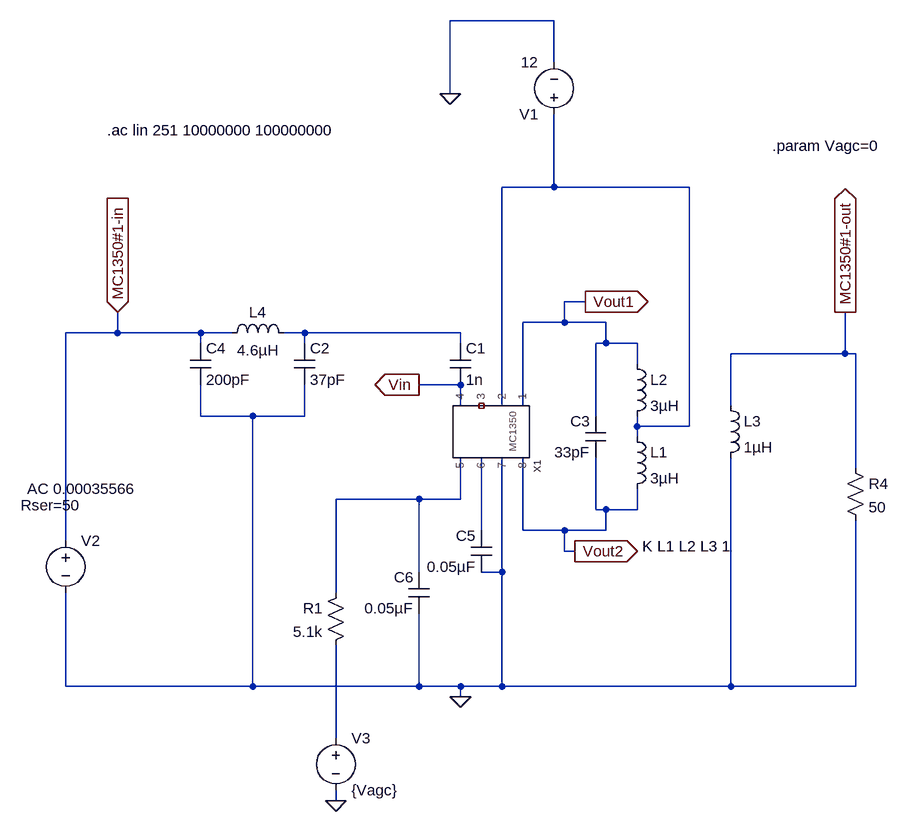
[diagram p0: schematic MC1350 test circuit 2.asc]
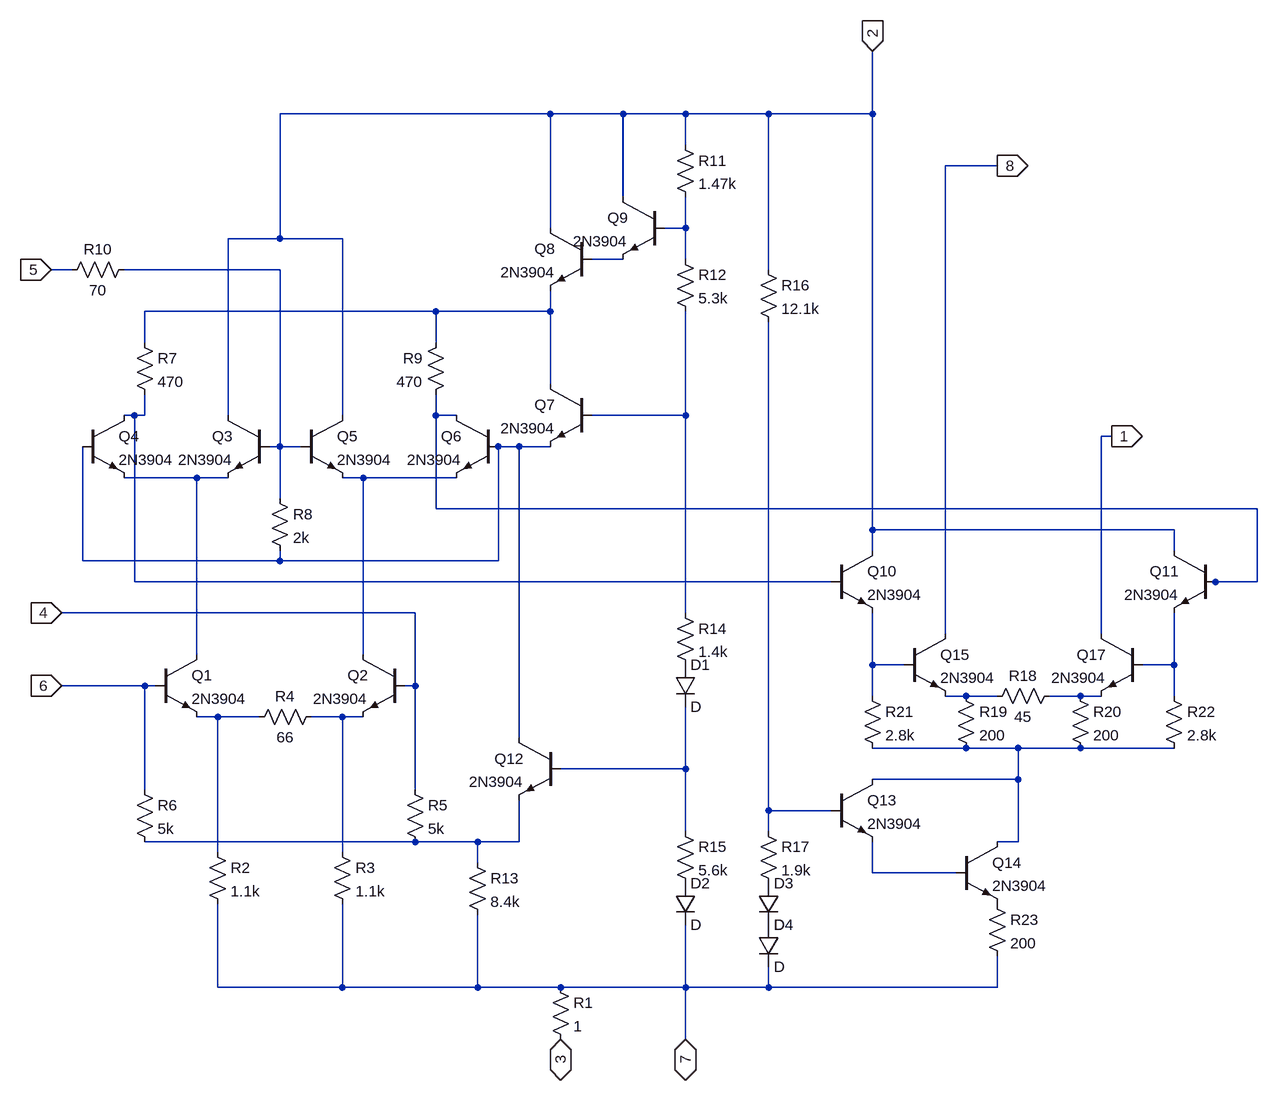
[diagram p1: sub-circuit mc1350_v1.asc]
MC1350 test circuit 2.asc, the LTspice schematic file:
Version 4.1
SHEET 1 1520 756
WIRE 320 -560 160 -560
WIRE 320 -496 320 -560
WIRE 160 -448 160 -560
WIRE 320 -304 320 -416
WIRE 320 -304 240 -304
WIRE 528 -304 320 -304
WIRE 368 -128 336 -128
WIRE 336 -96 336 -128
WIRE 336 -96 272 -96
WIRE 400 -96 336 -96
WIRE -352 -80 -352 -112
WIRE -352 -80 -432 -80
WIRE -224 -80 -352 -80
WIRE -176 -80 -224 -80
WIRE -64 -80 -96 -80
WIRE 176 -80 -64 -80
WIRE -224 -64 -224 -80
WIRE -64 -64 -64 -80
WIRE 176 -64 176 -80
WIRE 400 -64 400 -96
WIRE 400 -64 384 -64
WIRE 448 -64 400 -64
WIRE 768 -48 768 -112
WIRE 768 -48 592 -48
WIRE 784 -48 768 -48
WIRE 448 -32 448 -64
WIRE 176 0 112 0
WIRE 176 32 176 0
WIRE 240 32 240 -304
WIRE 272 32 272 -96
WIRE 592 32 592 -48
WIRE -224 48 -224 0
WIRE -144 48 -224 48
WIRE -64 48 -64 0
WIRE -64 48 -144 48
WIRE 384 48 384 -64
WIRE 448 64 448 48
WIRE 528 64 528 -304
WIRE 528 64 448 64
WIRE 448 80 448 64
WIRE 784 128 784 -48
WIRE 112 176 -16 176
WIRE 176 176 176 112
WIRE 176 176 112 176
WIRE 384 192 384 112
WIRE 400 192 384 192
WIRE 448 192 448 160
WIRE 448 192 400 192
WIRE 208 224 208 112
WIRE 272 224 272 112
WIRE 336 224 272 224
WIRE 400 224 400 192
WIRE 400 224 336 224
WIRE -432 240 -432 -80
WIRE 336 256 336 224
WIRE 352 256 336 256
WIRE 112 288 112 176
WIRE 240 288 240 112
WIRE 240 288 208 288
WIRE -16 320 -16 176
WIRE -432 464 -432 320
WIRE -144 464 -144 48
WIRE -144 464 -432 464
WIRE 112 464 112 352
WIRE 112 464 -144 464
WIRE 176 464 112 464
WIRE 240 464 240 288
WIRE 240 464 176 464
WIRE 592 464 592 112
WIRE 592 464 240 464
WIRE 784 464 784 208
WIRE 784 464 592 464
WIRE 176 480 176 464
WIRE -16 544 -16 400
WIRE -16 640 -16 624
FLAG 160 -448 0
FLAG 176 480 0
FLAG 768 -112 MC1350#1-out
IOPIN 768 -112 Out
FLAG -352 -112 MC1350#1-in
IOPIN -352 -112 In
FLAG -16 640 0
FLAG 112 0 Vin
IOPIN 112 0 Out
FLAG 368 -128 Vout1
IOPIN 368 -128 Out
FLAG 352 256 Vout2
IOPIN 352 256 Out
SYMBOL voltage 320 -400 R180
WINDOW 123 0 0 Left 0
WINDOW 39 0 0 Left 0
SYMATTR InstName V1
SYMATTR Value 12
SYMBOL voltage -432 224 R0
WINDOW 123 -59 -64 Left 2
WINDOW 39 -69 -39 Left 2
SYMATTR Value2 AC 0.00035566
SYMATTR SpiceLine Rser=50
SYMATTR InstName V2
SYMATTR Value ""
SYMBOL ind 432 64 R0
SYMATTR InstName L1
SYMATTR Value 3µH
SYMBOL cap 400 112 R180
WINDOW 0 24 56 Left 2
WINDOW 3 24 8 Left 2
SYMATTR InstName C3
SYMATTR Value 33pF
SYMBOL voltage -16 528 R0
WINDOW 123 0 0 Left 0
WINDOW 39 0 0 Left 0
SYMATTR InstName V3
SYMATTR Value {Vagc}
SYMBOL res 768 112 R0
SYMATTR InstName R4
SYMATTR Value 50
SYMBOL RF\ signal\ amps\\MC1350_v1 224 64 R90
SYMATTR InstName X1
SYMBOL ind 432 -48 R0
SYMATTR InstName L2
SYMATTR Value 3µH
SYMBOL ind 576 16 R0
SYMATTR InstName L3
SYMATTR Value 1µH
SYMBOL cap 160 -64 R0
SYMATTR InstName C1
SYMATTR Value 1n
SYMBOL cap -80 -64 R0
SYMATTR InstName C2
SYMATTR Value 37pF
SYMBOL cap -240 -64 R0
SYMATTR InstName C4
SYMATTR Value 200pF
SYMBOL ind -192 -64 R270
WINDOW 0 32 56 VTop 2
WINDOW 3 5 56 VBottom 2
SYMATTR InstName L4
SYMATTR Value 4.6µH
SYMBOL cap 224 224 M0
SYMATTR InstName C5
SYMATTR Value 0.05µF
SYMBOL cap 128 288 M0
SYMATTR InstName C6
SYMATTR Value 0.05µF
SYMBOL res 0 304 M0
SYMATTR InstName R1
SYMATTR Value 5.1k
TEXT -368 -392 Left 2 !.ac lin 251 10000000 100000000
TEXT 656 -368 Left 2 !.param Vagc=0
TEXT 456 248 Left 2 !K L1 L2 L3 1

mc1350_v1.asc, the sub-circuit schematic file:
Version 4.1
SHEET 1 2180 940
WIRE 608 -576 192 -576
WIRE 720 -576 608 -576
WIRE 816 -576 720 -576
WIRE 944 -576 816 -576
WIRE 1104 -576 1104 -672
WIRE 1104 -576 944 -576
WIRE 816 -528 816 -576
WIRE 1296 -496 1216 -496
WIRE 720 -448 720 -576
WIRE 608 -400 608 -576
WIRE 816 -400 816 -448
WIRE 816 -400 784 -400
WIRE 192 -384 192 -576
WIRE 192 -384 112 -384
WIRE 288 -384 192 -384
WIRE 720 -352 672 -352
WIRE 816 -352 816 -400
WIRE -128 -336 -160 -336
WIRE 192 -336 -48 -336
WIRE 944 -336 944 -576
WIRE 432 -272 -16 -272
WIRE 608 -272 608 -304
WIRE 608 -272 432 -272
WIRE -16 -224 -16 -272
WIRE 432 -224 432 -272
WIRE 608 -160 608 -272
WIRE -32 -112 -48 -112
WIRE -16 -112 -16 -144
WIRE -16 -112 -32 -112
WIRE 112 -112 112 -384
WIRE 288 -112 288 -384
WIRE 432 -112 432 -144
WIRE 464 -112 432 -112
WIRE 816 -112 816 -272
WIRE 816 -112 672 -112
WIRE 1472 -80 1456 -80
WIRE 192 -64 192 -336
WIRE 192 -64 176 -64
WIRE 224 -64 192 -64
WIRE 528 -64 512 -64
WIRE 560 -64 528 -64
WIRE 608 -64 560 -64
WIRE 64 -16 -48 -16
WIRE 112 -16 64 -16
WIRE 320 -16 288 -16
WIRE 464 -16 320 -16
WIRE 192 16 192 -64
WIRE 432 32 432 -112
WIRE 1696 32 432 32
WIRE 1104 64 1104 -576
WIRE 1568 64 1104 64
WIRE 1104 96 1104 64
WIRE 1568 96 1568 64
WIRE -112 112 -112 -64
WIRE 192 112 192 96
WIRE 192 112 -112 112
WIRE 528 112 528 -64
WIRE 528 112 192 112
WIRE -32 144 -32 -112
WIRE 1040 144 -32 144
WIRE 1632 144 1616 144
WIRE 1696 144 1696 32
WIRE 1696 144 1632 144
WIRE 400 192 -144 192
WIRE 816 192 816 -112
WIRE 1216 224 1216 -496
WIRE 1456 224 1456 -80
WIRE 64 256 64 -16
WIRE 320 256 320 -16
WIRE 1104 272 1104 192
WIRE 1152 272 1104 272
WIRE 1568 272 1568 192
WIRE 1568 272 1520 272
WIRE -16 304 -144 304
WIRE 0 304 -16 304
WIRE 400 304 400 192
WIRE 400 304 384 304
WIRE 1104 320 1104 272
WIRE 1248 320 1216 320
WIRE 1296 320 1248 320
WIRE 1424 320 1376 320
WIRE 1456 320 1424 320
WIRE 1568 320 1568 272
WIRE 96 352 64 352
WIRE 160 352 96 352
WIRE 288 352 240 352
WIRE 320 352 288 352
WIRE 560 384 560 -64
WIRE 1248 400 1104 400
WIRE 1328 400 1248 400
WIRE 1424 400 1328 400
WIRE 1568 400 1424 400
WIRE 816 432 816 336
WIRE 816 432 624 432
WIRE 1328 448 1328 400
WIRE 1328 448 1104 448
WIRE -16 464 -16 304
WIRE 400 464 400 304
WIRE 944 496 944 -256
WIRE 1040 496 944 496
WIRE 816 528 816 432
WIRE 944 528 944 496
WIRE 400 544 -16 544
WIRE 496 544 400 544
WIRE 560 544 560 480
WIRE 560 544 496 544
WIRE 1328 544 1328 448
WIRE 1328 544 1296 544
WIRE 96 560 96 352
WIRE 288 560 288 352
WIRE 496 576 496 544
WIRE 1104 592 1104 544
WIRE 1232 592 1104 592
WIRE 96 768 96 640
WIRE 288 768 288 640
WIRE 288 768 96 768
WIRE 496 768 496 656
WIRE 496 768 288 768
WIRE 624 768 496 768
WIRE 816 768 816 672
WIRE 816 768 624 768
WIRE 944 768 944 736
WIRE 944 768 816 768
WIRE 1296 768 1296 720
WIRE 1296 768 944 768
WIRE 816 848 816 768
FLAG -144 304 6
IOPIN -144 304 In
FLAG 816 848 7
IOPIN 816 848 BiDir
FLAG -144 192 4
IOPIN -144 192 In
FLAG -160 -336 5
IOPIN -160 -336 In
FLAG 1104 -672 2
IOPIN 1104 -672 In
FLAG 1296 -496 8
IOPIN 1296 -496 Out
FLAG 1472 -80 1
IOPIN 1472 -80 Out
FLAG 624 848 3
IOPIN 624 848 BiDir
SYMBOL res 80 544 R0
SYMATTR InstName R2
SYMATTR Value 1.1k
SYMBOL npn 0 256 R0
SYMATTR InstName Q1
SYMATTR Value 2N3904
SYMBOL npn 384 256 M0
SYMATTR InstName Q2
SYMATTR Value 2N3904
SYMBOL res 272 544 R0
SYMATTR InstName R3
SYMATTR Value 1.1k
SYMBOL res 256 336 R90
WINDOW 0 0 56 VBottom 2
WINDOW 3 32 56 VTop 2
SYMATTR InstName R4
SYMATTR Value 66
SYMBOL res 384 448 R0
SYMATTR InstName R5
SYMATTR Value 5k
SYMBOL res -32 448 R0
SYMATTR InstName R6
SYMATTR Value 5k
SYMBOL npn 176 -112 M0
SYMATTR InstName Q3
SYMATTR Value 2N3904
SYMBOL npn -112 -112 R0
SYMATTR InstName Q4
SYMATTR Value 2N3904
SYMBOL res -32 -240 R0
SYMATTR InstName R7
SYMATTR Value 470
SYMBOL res 176 0 R0
SYMATTR InstName R8
SYMATTR Value 2k
SYMBOL npn 224 -112 R0
SYMATTR InstName Q5
SYMATTR Value 2N3904
SYMBOL npn 528 -112 M0
SYMATTR InstName Q6
SYMATTR Value 2N3904
SYMBOL res 448 -240 M0
SYMATTR InstName R9
SYMATTR Value 470
SYMBOL res -32 -352 R90
WINDOW 0 0 56 VBottom 2
WINDOW 3 32 56 VTop 2
SYMATTR InstName R10
SYMATTR Value 70
SYMBOL npn 672 -160 M0
SYMATTR InstName Q7
SYMATTR Value 2N3904
SYMBOL npn 672 -400 M0
SYMATTR InstName Q8
SYMATTR Value 2N3904
SYMBOL npn 784 -448 M0
SYMATTR InstName Q9
SYMATTR Value 2N3904
SYMBOL res 800 -544 R0
SYMATTR InstName R11
SYMATTR Value 1.47k
SYMBOL res 800 -368 R0
SYMATTR InstName R12
SYMATTR Value 5.3k
SYMBOL npn 1040 96 R0
SYMATTR InstName Q10
SYMATTR Value 2N3904
SYMBOL npn 1632 96 M0
SYMATTR InstName Q11
SYMATTR Value 2N3904
SYMBOL npn 624 384 M0
SYMATTR InstName Q12
SYMATTR Value 2N3904
SYMBOL res 480 560 R0
SYMATTR InstName R13
SYMATTR Value 8.4k
SYMBOL res 800 176 R0
SYMATTR InstName R14
SYMATTR Value 1.4k
SYMBOL diode 800 272 R0
SYMATTR InstName D1
SYMBOL res 800 512 R0
SYMATTR InstName R15
SYMATTR Value 5.6k
SYMBOL diode 800 608 R0
SYMATTR InstName D2
SYMBOL res 928 -352 R0
SYMATTR InstName R16
SYMATTR Value 12.1k
SYMBOL res 928 512 R0
SYMATTR InstName R17
SYMATTR Value 1.9k
SYMBOL diode 928 608 R0
SYMATTR InstName D3
SYMBOL diode 928 672 R0
SYMATTR InstName D4
SYMBOL npn 1040 448 R0
SYMATTR InstName Q13
SYMATTR Value 2N3904
SYMBOL npn 1232 544 R0
SYMATTR InstName Q14
SYMATTR Value 2N3904
SYMBOL npn 1152 224 R0
SYMATTR InstName Q15
SYMATTR Value 2N3904
SYMBOL res 1392 304 R90
WINDOW 0 0 56 VBottom 2
WINDOW 3 32 56 VTop 2
SYMATTR InstName R18
SYMATTR Value 45
SYMBOL npn 1520 224 M0
SYMATTR InstName Q17
SYMATTR Value 2N3904
SYMBOL res 1232 304 R0
SYMATTR InstName R19
SYMATTR Value 200
SYMBOL res 1408 304 R0
SYMATTR InstName R20
SYMATTR Value 200
SYMBOL res 1088 304 R0
SYMATTR InstName R21
SYMATTR Value 2.8k
SYMBOL res 1552 304 R0
SYMATTR InstName R22
SYMATTR Value 2.8k
SYMBOL res 1280 624 R0
SYMATTR InstName R23
SYMATTR Value 200
SYMBOL res 608 752 R0
SYMATTR InstName R1
SYMATTR Value 1

The netlist it stands for:
* MC1350 test circuit 2.asc
V1 N001 0 12
V2 MC1350#1-in 0 AC 0.00035566 Rser=50
L1 N001 Vout2 3µH
C3 Vout2 Vout1 33pF
V3 N005 0 {Vagc}
R4 MC1350#1-out 0 50
X§X1 Vout1 N001 NC_01 Vin N003 N004 0 Vout2 mc1350_v1
L2 Vout1 N001 3µH
L3 MC1350#1-out 0 1µH
C1 N002 Vin 1n
C2 N002 0 37pF
C4 MC1350#1-in 0 200pF
L4 MC1350#1-in N002 4.6µH
C5 N004 0 0.05µF
C6 N003 0 0.05µF
R1 N003 N005 5.1k

* block symbol definitions
.subckt mc1350_v1 1 2 3 4 5 6 7 8
R2 N015 7 1.1k
Q1 N009 6 N015 0 2N3904
Q2 N010 4 N016 0 2N3904
R3 N016 7 1.1k
R4 N016 N015 66
R5 4 N020 5k
R6 6 N020 5k
Q3 2 N003 N009 0 2N3904
Q4 N005 N008 N009 0 2N3904
R7 N004 N005 470
R8 N003 N008 2k
Q5 2 N003 N010 0 2N3904
Q6 N006 N008 N010 0 2N3904
R9 N004 N006 470
R10 N003 5 70
Q7 N004 N007 N008 0 2N3904
Q8 2 N002 N004 0 2N3904
Q9 2 N001 N002 0 2N3904
R11 2 N001 1.47k
R12 N001 N007 5.3k
Q10 2 N005 N011 0 2N3904
Q11 2 N006 N012 0 2N3904
Q12 N008 N018 N020 0 2N3904
R13 N020 7 8.4k
R14 N007 P001 1.4k
D1 P001 N018 D
R15 N018 P002 5.6k
D2 P002 7 D
R16 2 N019 12.1k
R17 N019 P003 1.9k
D3 P003 P004 D
D4 P004 7 D
Q13 N017 N019 N021 0 2N3904
Q14 N017 N021 P005 0 2N3904
Q15 8 N011 N013 0 2N3904
R18 N014 N013 45
Q17 1 N012 N014 0 2N3904
R19 N013 N017 200
R20 N014 N017 200
R21 N011 N017 2.8k
R22 N012 N017 2.8k
R23 P005 7 200
R1 7 3 1
.ends mc1350_v1

.model D D
.lib standard.dio
.model NPN NPN
.model PNP PNP
.lib standard.bjt
.ac lin 251 10000000 100000000
.param Vagc=0
K L1 L2 L3 1
.backanno
.end